# Altium project Final_Project.PrjPcb
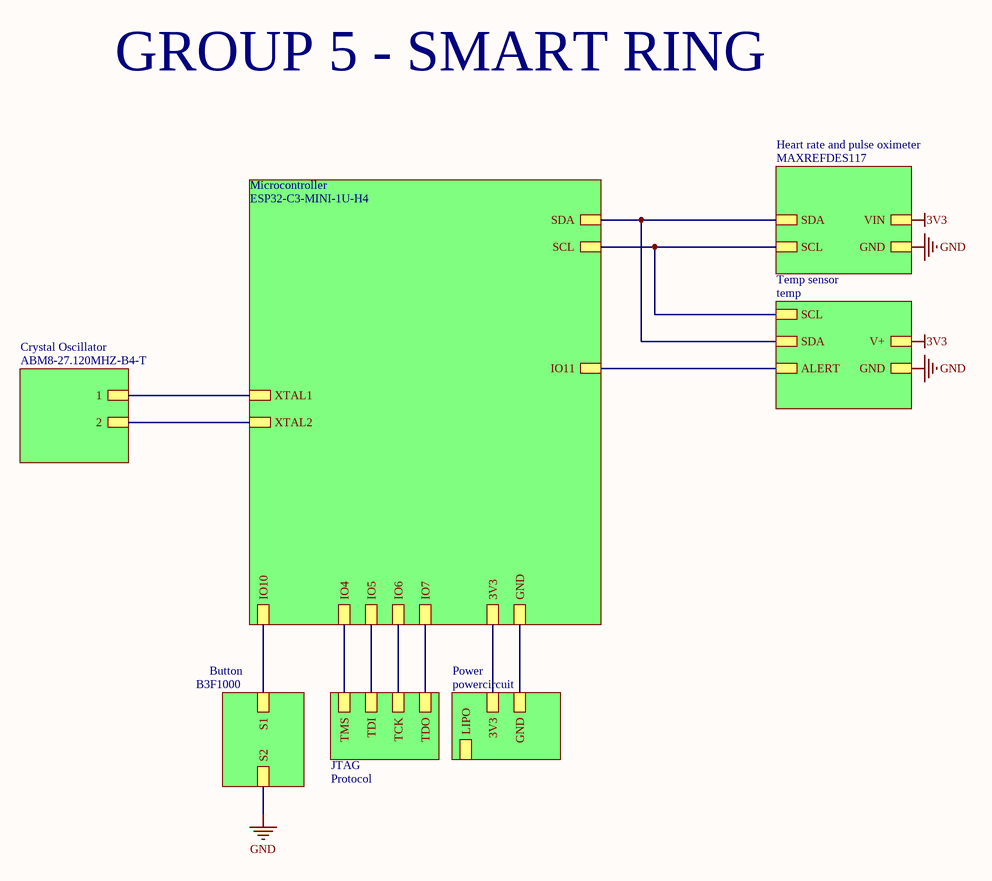
[diagram p0: mainsheet.SchDoc]
7 sheets, 39 parts. Net scope: hierarchical (ports join the sheet entries above them; power ports are global).
Board files: PCB2.PcbDoc, PCB4.PcbDoc
Sheets:
  mainsheet.SchDoc
    Heart rate and pulse oximeter = MAXREFDES117.SchDoc
    Button = B3F1000.SchDoc
    Temp sensor = temp.SchDoc
    Microcontroller = ESP32-C3-MINI-1U-H4.SchDoc
    Power = powercircuit.SchDoc
    Crystal Oscillator = ABM8-27.120MHZ-B4-T.SchDoc

## Sheet mainsheet.SchDoc
size A4; SheetNumber: 1; SheetTotal: 8

### Sub-sheets
Button = B3F1000: S1, S2
Crystal Oscillator = ABM8-27.120MHZ-B4-T: 1, 2
Heart rate and pulse oximeter = MAXREFDES117: SCL, SDA, GND, VIN
Microcontroller = ESP32-C3-MINI-1U-H4: GND, 3V3, IO10, IO4, IO5, IO6, IO7, SCL, SDA, XTAL1, XTAL2, IO11
Power = powercircuit: 3V3, GND, LIPO
Protocol = JTAG (file not in this document): TDO, TCK, TDI, TMS
Temp sensor = temp: SCL, GND, ALERT, V+, SDA

### Nets
3V3: sheet Heart rate and pulse oximeter/VIN, sheet Temp sensor/V+  [project net VIN]
GND: sheet Heart rate and pulse oximeter/GND, sheet Button/S2, sheet Temp sensor/GND
GPIO2: sheet Temp sensor/ALERT, sheet Microcontroller/IO11
GPIO18: sheet Heart rate and pulse oximeter/SCL, sheet Temp sensor/SCL, sheet Microcontroller/SCL
GPIO19: sheet Heart rate and pulse oximeter/SDA, sheet Temp sensor/SDA, sheet Microcontroller/SDA
To_Lipo_Bat: sheet Microcontroller/3V3, sheet Power/3V3, sheet Power/LIPO
XTAL_32K_N: sheet Microcontroller/XTAL2, sheet Crystal Oscillator/2
XTAL_32K_P: sheet Microcontroller/XTAL1, sheet Crystal Oscillator/1
NetC13_1: sheet Microcontroller/GND, sheet Power/GND
NetIC1_16: sheet Button/S1, sheet Microcontroller/IO10
NetIC1_18: sheet Microcontroller/IO4, sheet Protocol/TMS
NetIC1_19: sheet Microcontroller/IO5, sheet Protocol/TDI
NetIC1_20: sheet Microcontroller/IO6, sheet Protocol/TCK
NetIC1_21: sheet Microcontroller/IO7, sheet Protocol/TDO

### Notes on the sheet
- GROUP 5 - SMART RING

## Sheet MAXREFDES117.SchDoc
size A; SheetNumber: 2; SheetTotal: 8
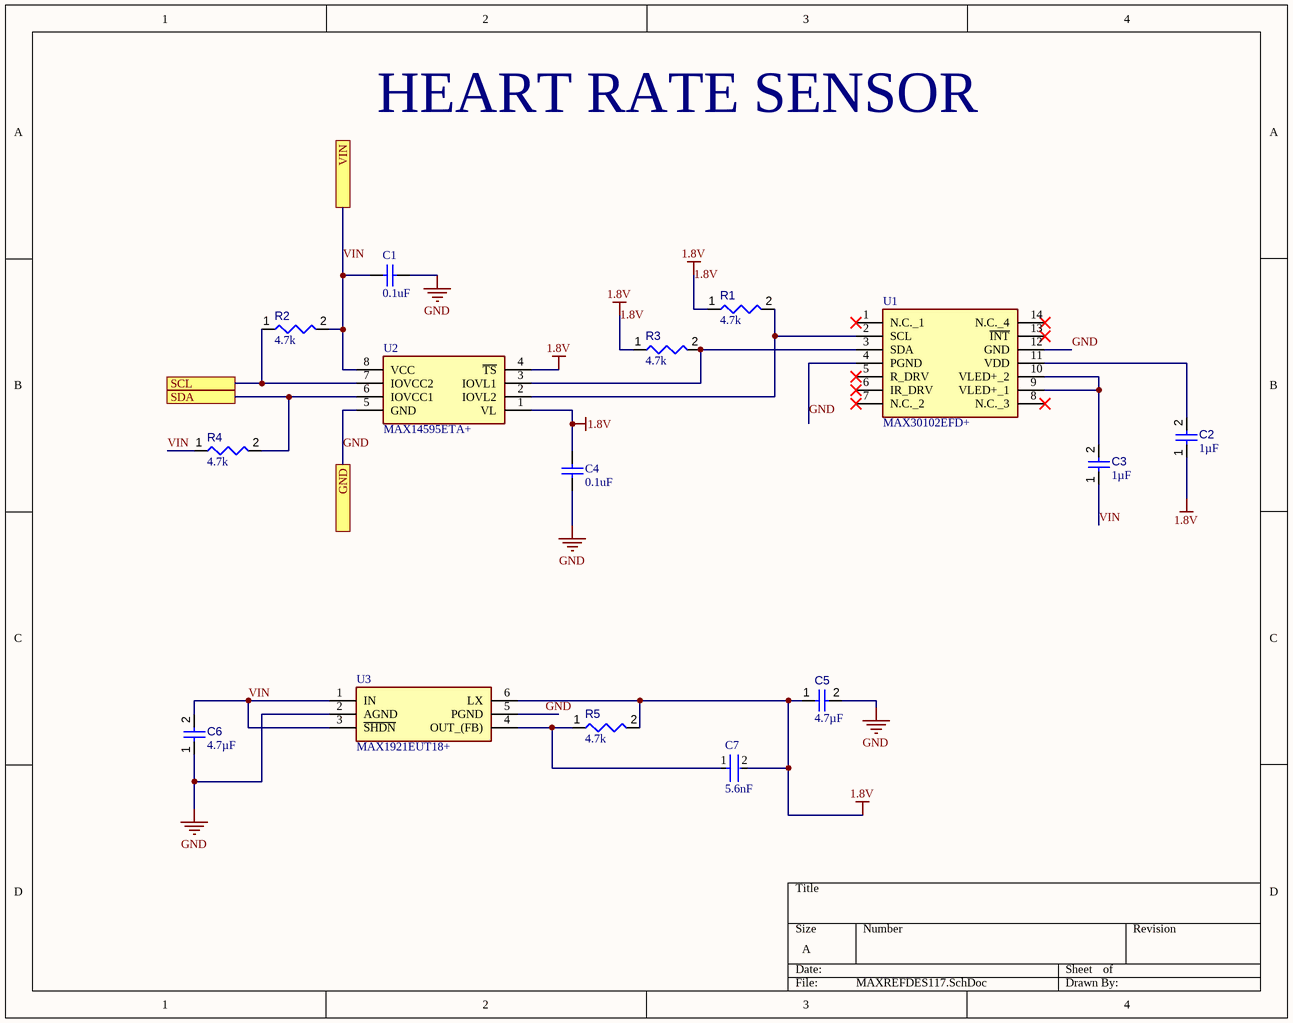
[diagram p1: MAXREFDES117.SchDoc]

### Parts
C1  0.1uF  [CAPC1608X90X35ML10T15]
C2  value 1µF  [CAPC0402(1005)60_L]  (hidden comment: Capacitor 1µF +/-20% 10V 0402)
C3  value 1µF  [CAPC0402(1005)60_L]  (hidden comment: Capacitor 1µF +/-20% 10V 0402)
C4  0.1uF  [CAPC1608X90X35ML10T15]
C5  value 4.7µF  [CAPC0603(1608)100_L]  (hidden comment: Capacitor 4.7µF +/-20% 10V 0603)
C6  value 4.7µF  [CAPC0603(1608)100_L]  (hidden comment: Capacitor 4.7µF +/-20% 10V 0603)
C7  5.6nF  [FP-C0603C-CF-MFG]
R1  value 4.7k  [RESC0402(1005)_L]  (hidden comment: 4D7KR2F)
R2  value 4.7k  [RESC0402(1005)_L]  (hidden comment: 4D7KR2F)
R3  value 4.7k  [RESC0402(1005)_L]  (hidden comment: 4D7KR2F)
R4  value 4.7k  [RESC0402(1005)_L]  (hidden comment: 4D7KR2F)
R5  value 4.7k  [RESC0402(1005)_L]  (hidden comment: 4D7KR2F)
U1  MAX30102EFD+  [14-LEAD-OESIP]
U2  MAX14595ETA+  [MAX14595ETA]
U3  MAX1921EUT18+  [SOT95P280X145-6N]

### Ports
GND (see mainsheet[4B], temp[3B]), SCL (see mainsheet[3B], ESP32-C3-MINI-1U-H4[2C], temp[2B]), SDA (see mainsheet[3B], ESP32-C3-MINI-1U-H4[2C], temp[2B]), VIN (see mainsheet[4B])

### Nets
1.8V: C2.1 C4.2 C5.1 C7.2 R1.1 R3.1 R5.2 U2.1(VL) U2.4(~{TS}) U3.6(LX)
GND: C1.1 C4.1 C5.2 C6.1 U1.4(PGND) U1.12(GND) U2.5(GND) U3.2(AGND) U3.5(PGND) ; port GND
VIN: C1.2 C3.1 C6.2 R2.2 R4.1 U2.8(VCC) U3.1(IN) U3.3(~{SHDN}) ; port VIN
GPIO18: R2.1 U2.7(IOVCC2) ; port SCL
GPIO19: R4.2 U2.6(IOVCC1) ; port SDA
NetC2_2: C2.2 U1.11(VDD)
NetC3_2: C3.2 U1.9(VLED+_1) U1.10(VLED+_2)
NetC7_1: C7.1 R5.1 U3.4(OUT_(FB))
NetR1_2: R1.2 U1.2(SCL) U2.2(IOVL2)
NetR3_2: R3.2 U1.3(SDA) U2.3(IOVL1)

Not connected (* = marked no-connect by the designer): U1 1(N.C._1)* 5(R_DRV)* 6(IR_DRV)* 7(N.C._2)* 8(N.C._3)* 13(~{INT})* 14(N.C._4)*

### Notes on the sheet
- HEART RATE SENSOR

### Library data of the parts
C1 C4 = CMP-2100-03643-1: Chip Capacitor, 0.1 uF, +/- 10%, 50 V, -55 to 125 degC, 0603 (1608 Metric), RoHS, Tape and Reel; Manufacturer: Murata; Dielectric Material: Ceramic; Voltage Rating: 50V; Capacitance: 100nF; Dielectric: X7R; Insulation Resistance: 10GR; Case Code (Metric): 1608; Lead Free: LeadFree; Depth: 0.8mm; Number of Pins: 2; Radiation Hardening: No; Case/Package: 0603; Manufacturer URL: http://www.murata.com/; Packaging: TapeandReel; Length: 1.6mm; Contact Plating: Tin; Datasheet URL: http://psearch.en.murata.com/capacitor/product/GRM188R71H104KA93%23.pdf; Tolerance: 10%; Case Code (Imperial): 0603; Min Operating Temperature: -55degC; RoHSCompliant: true; Voltage: 50V; Termination: SMD/SMT; Mount: SurfaceMount; Material: Ceramic; Package Quantity: 1; Height: 0.8mm; Thickness: 0.035inch; REACH SVHC: NoSVHC; Max Operating Temperature: 125degC; Width: 0.8mm; Package Reference: 0603; Voltage Rating (DC): 50V; Datasheet Version: 42675.0; Package Description: 2-Pin Surface Mount Device, Body 1.6 x 0.8 mm
C2 C3 = CMP-001-00063-3: Chip Capacitor, 1µF +/-20%, 10V, 0402, Thickness 0.6 mm; Tolerance: 10%; Mounting Technology: SMT; Max Operating Temperature: 85°C; Voltage Rating: 10V; Pins: 2; Case/Package: 0402; Min Operating Temperature: -55°C
C5 C6 = CMP-001-00076-4: Chip Capacitor, 4.7µF +/-20%, 10V, 0603, Thickness 1 mm; Tolerance: 10%; Mounting Technology: SMT; Case/Package: 0603; Pins: 2; Min Operating Temperature: -55°C; Max Operating Temperature: 85°C; Voltage Rating: 10V
C7 = CMP-2006-03359-2: CAP CER 5600PF 50V NP0 0603; Manufacturer: KEMET; Manufacturer Part Number: C0603C562J5GACTU; Material: Ceramic; Value: 5,600 pF; Tolerance: 0.05; Temperature Coefficient: 30ppm/°C; Temperature Characteristic: C0G; Automotive Grade: Grade 1; Device Class L1: Passive Components; Category: Cap; Temperature Range Low: -55°C; Voltage Rating: 50 V; ComponentLink2Description: Datasheet; Height: 0.87mm; Octopart: https://octopart.com/c0603c562j5gactu-kemet-13174209; Mouser Description: Multilayer Ceramic Capacitors MLCC - SMD/SMT 50volts 5600pF 5% C0G; Device Class L3: Ceramic Capacitors; Package: C0603C-CF; Temperature Range High: +125°C; Automotive: Yes; ComponentLink2URL: https://api.kemet.com/component-edge/download/datasheet/C0603C100J5GACAUTO.pdf; RoHS: TRUE; Device Class L2: Capacitors; Digikey Description: CAP CER 5600PF 50V NP0 0603; Temperature: -55°C to +125°C; Capacitance: 5,600 pF; Lead Free: Yes
R1-R5 = CMP-009-00105-2: 4K7 0.063W 1% 0402 (1005 Metric)  SMD; Power: 63mW; Mounting Technology: SMT; Case/Package: 0402; Tolerance: 1%; Pins: 2
U1 = MAX30102EFD+: Integrated Circuit; Manufacturer_Name: Analog Devices; Datasheet Link: https://datasheets.maximintegrated.com/en/ds/MAX30102.pdf; Manufacturer_Part_Number: MAX30102EFD+; Mouser Part Number: 700-MAX30102EFD+; Mouser Price/Stock: https://www.mouser.co.uk/ProductDetail/Analog-Devices-Maxim-Integrated/MAX30102EFD%2b?qs=nVS1qgv%252BQrk9UYEvS27V%2Fg%3D%3D
U2 = MAX14595ETA+: Integrated Circuit; Manufacturer_Name: Analog Devices; Datasheet Link: https://www.mouser.it/datasheet/2/256/MAX14595-471922.pdf; Height: 0.8mm; Manufacturer_Part_Number: MAX14595ETA+; Mouser Part Number: 700-MAX14595ETA+; Mouser Price/Stock: https://www.mouser.co.uk/ProductDetail/Maxim-Integrated/MAX14595ETA%2b?qs=Or6ezLSzmEvDejm1TC8ZVA%3D%3D
U3 = MAX1921EUT18+: Integrated Circuit; Manufacturer_Name: Analog Devices; Datasheet Link: https://datasheet.datasheetarchive.com/originals/distributors/SFDatasheet-4/sf-00087114.pdf; Height: 1.45mm; Manufacturer_Part_Number: MAX1921EUT18+

## Sheet B3F1000.SchDoc
size A; SheetNumber: 7; SheetTotal: 8
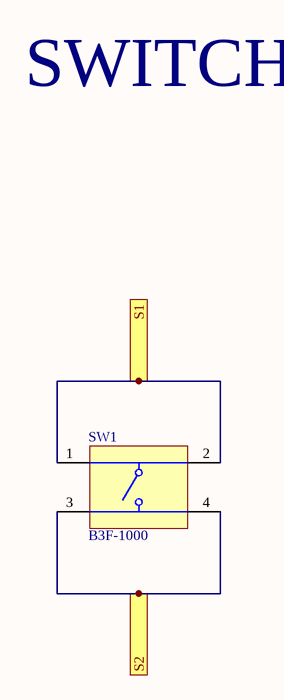
[diagram p2: B3F1000.SchDoc]

### Parts
SW1  B3F-1000  [OMRON-B3F-1000-4_V]

### Ports
S1 (see mainsheet[2C]), S2 (see mainsheet[2D])

### Nets
GND: SW1.3 SW1.4 ; port S2
NetIC1_16: SW1.1 SW1.2 ; port S1

### Notes on the sheet
- SWITCH

### Library data of the parts
SW1 = CMP-1677-00002-1: Tactile Switch, SPST-NO, 0.05 A, 5 to 24 V, -25 to 70 degC, 4-Pin THD, RoHS, Bulk; Shielding: Shielded; Gender: Female; Capacitance: -45 f; Voltage Rating: 150 V; Current Rating: 1.5 A; Radiation Hardening: No; Contact Plating: Gold; Height: 14.99 mm; Min Operating Temperature: -40 degC; Packaging: Tray; ComponentLink2Description: Datasheet; ComponentLink1URL: http://www.omron.com/; Lead Pitch: 1.27 mm; RoHSCompliant: true; Pins: 8; PackageReference: B3F-1000; Width: 25.4 mm; Contact Material: Brass; ComponentLink2URL: http://www.omron.com/ecb/products/pdf/en-b3f.pdf; PackageDescription: 4-Pin Through Hole Device, Body 6 x 6 mm; DatasheetVersion: Jan-15; ComponentLink1Description: Manufacturer URL; Package Quantity: 1080; Mount: Through Hole; Length: 18.34 mm; Max Operating Temperature: 70 degC

## Sheet temp.SchDoc
size A4; SheetNumber: 3; SheetTotal: 8
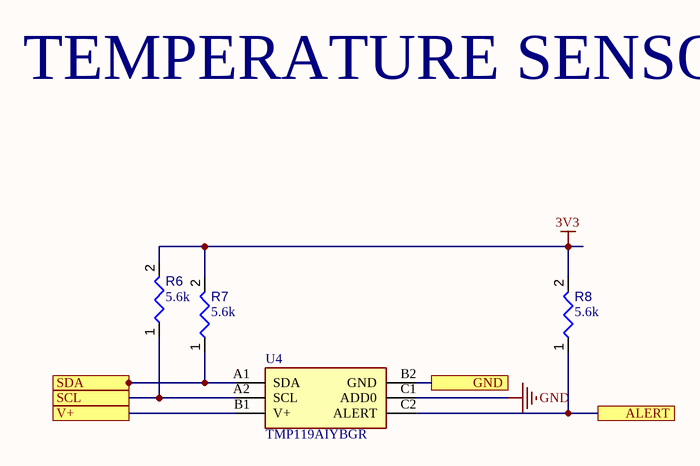
[diagram p3: temp.SchDoc]

### Parts
R6  value 5.6k  [RESC0402(1005)_L]  (hidden comment: Resistor 5K6  +/-5 % 0402 63 mW)
R7  value 5.6k  [RESC0402(1005)_L]  (hidden comment: Resistor 5K6  +/-5 % 0402 63 mW)
R8  value 5.6k  [RESC0402(1005)_L]  (hidden comment: Resistor 5K6  +/-5 % 0402 63 mW)
U4  TMP119AIYBGR  [BGA6C40P2X3_95X149X52]

### Ports
ALERT (see mainsheet[3B]), GND (see mainsheet[4B], MAXREFDES117[2C]), SCL (see mainsheet[3B], ESP32-C3-MINI-1U-H4[2C], MAXREFDES117[1B]), SDA (see mainsheet[3B], ESP32-C3-MINI-1U-H4[2C], MAXREFDES117[1B]), V+ (see mainsheet[4B])

### Nets
3V3: R6.2 R7.2 R8.2 U4.B1(V+) ; port V+  [project net VIN]
GND: U4.B2(GND) U4.C1(ADD0) ; port GND
GPIO2: R8.1 U4.C2(ALERT) ; port ALERT
GPIO18: R6.1 U4.A2(SCL) ; port SCL
GPIO19: R7.1 U4.A1(SDA) ; port SDA

### Notes on the sheet
- TEMPERATURE SENSOR

### Library data of the parts
R6-R8 = CMP-009-00136-3: Chip Resistor, 5,6 kOhms, +/-5 %, 63 mW, -55 to 155 degC, 0402; Power: 63mW; Tolerance: 5%; Max Operating Temperature: 155°C; Case/Package: 0402; Min Operating Temperature: -55°C; Pins: 2
U4 = TMP119AIYBGR: Integrated Circuit; Manufacturer_Name: Texas Instruments; Datasheet Link: https://www.ti.com/lit/ds/symlink/tmp119.pdf?ts=1711471230059&ref_url=https%253A%252F%252Fwww.ti.com%252Fsitesearch%252Fen-us%252Fdocs%252Funiversalsearch.tsp%253FlangPref%253Den-US%2526searchTerm%253Dtmp119%2526nr%253D70; Height: 0.525mm; Manufacturer_Part_Number: TMP119AIYBGR; Mouser Part Number: 595-TMP119AIYBGR; Mouser Price/Stock: https://www.mouser.co.uk/ProductDetail/Texas-Instruments/TMP119AIYBGR?qs=dbcCsuKDzFUz%2FSabBerKMA%3D%3D

## Sheet ESP32-C3-MINI-1U-H4.SchDoc
size A; SheetNumber: 4; SheetTotal: 8
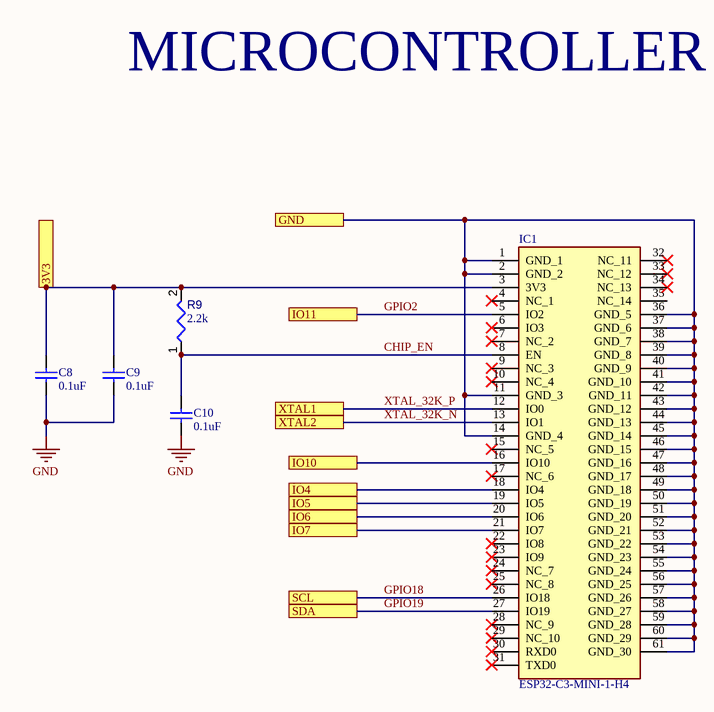
[diagram p4: ESP32-C3-MINI-1U-H4.SchDoc]

### Parts
C8  0.1uF  [CAPC1608X90X35ML10T15]
C9  0.1uF  [CAPC1608X90X35ML10T15]
C10  0.1uF  [CAPC1608X90X35ML10T15]
IC1  ESP32-C3-MINI-1-H4  [ESP32C3MINI1H4]
R9  value 2.2k  [RESC0402(1005)_L]  (hidden comment: Resistor 2K2  +/-5 % 0402 63 mW)

### Ports
3V3 (see mainsheet[3C], powercircuit[1B]), GND (see mainsheet[3C], powercircuit[1C]), IO4 (see mainsheet[2C]), IO5 (see mainsheet[2C]), IO6 (see mainsheet[2C]), IO7 (see mainsheet[2C]), IO10 (see mainsheet[2C]), IO11 (see mainsheet[3B]), SCL (see mainsheet[3B], MAXREFDES117[1B], temp[2B]), SDA (see mainsheet[3B], MAXREFDES117[1B], temp[2B]), XTAL1 (see mainsheet[2B]), XTAL2 (see mainsheet[2B])

### Nets
GND: C8.2 C9.2 C10.2
CHIP_EN: C10.1 IC1.8(EN) R9.1
GPIO2: IC1.5(IO2) ; port IO11
GPIO18: IC1.26(IO18) ; port SCL
GPIO19: IC1.27(IO19) ; port SDA
To_Lipo_Bat: C8.1 C9.1 IC1.3(3V3) R9.2 ; port 3V3
XTAL_32K_N: IC1.13(IO1) ; port XTAL2
XTAL_32K_P: IC1.12(IO0) ; port XTAL1
NetC13_1: IC1.1(GND_1) IC1.2(GND_2) IC1.11(GND_3) IC1.14(GND_4) IC1.36(GND_5) IC1.37(GND_6) IC1.38(GND_7) IC1.39(GND_8) IC1.40(GND_9) IC1.41(GND_10) IC1.42(GND_11) IC1.43(GND_12) IC1.44(GND_13) IC1.45(GND_14) IC1.46(GND_15) IC1.47(GND_16) IC1.48(GND_17) IC1.49(GND_18) IC1.50(GND_19) IC1.51(GND_20) IC1.52(GND_21) IC1.53(GND_22) IC1.54(GND_23) IC1.55(GND_24) IC1.56(GND_25) IC1.57(GND_26) IC1.58(GND_27) IC1.59(GND_28) IC1.60(GND_29) IC1.61(GND_30) ; port GND
NetIC1_16: IC1.16(IO10) ; port IO10
NetIC1_18: IC1.18(IO4) ; port IO4
NetIC1_19: IC1.19(IO5) ; port IO5
NetIC1_20: IC1.20(IO6) ; port IO6
NetIC1_21: IC1.21(IO7) ; port IO7

Not connected (* = marked no-connect by the designer): IC1 4(NC_1)* 6(IO3)* 7(NC_2)* 9(NC_3)* 10(NC_4)* 15(NC_5)* 17(NC_6)* 22(IO8)* 23(IO9)* 24(NC_7)* 25(NC_8)* 28(NC_9)* 29(NC_10)* 30(RXD0)* 31(TXD0)* 32(NC_11)* 33(NC_12)* 34(NC_13)* 35(NC_14)

### Notes on the sheet
- MICROCONTROLLER

### Library data of the parts
C8-C10 = CMP-2100-03643-1: as C1 on sheet MAXREFDES117; Case Code (Metric): 1608; Lead Free: LeadFree; Depth: 0.8mm; Number of Pins: 2; Radiation Hardening: No; Case/Package: 0603; Manufacturer URL: http://www.murata.com/; Packaging: TapeandReel; Length: 1.6mm; Contact Plating: Tin; Datasheet URL: http://psearch.en.murata.com/capacitor/product/GRM188R71H104KA93%23.pdf; Tolerance: 10%; Case Code (Imperial): 0603; Min Operating Temperature: -55degC; RoHSCompliant: true; Voltage: 50V; Termination: SMD/SMT; Mount: SurfaceMount; Material: Ceramic; Package Quantity: 1; Height: 0.8mm; Thickness: 0.035inch; REACH SVHC: NoSVHC; Max Operating Temperature: 125degC; Width: 0.8mm; Package Reference: 0603; Voltage Rating (DC): 50V; Datasheet Version: 42675.0; Package Description: 2-Pin Surface Mount Device, Body 1.6 x 0.8 mm
IC1 = ESP32-C3-MINI-1-H4: Integrated Circuit; Manufacturer_Name: Espressif Systems; Datasheet Link: https://www.mouser.es/datasheet/2/891/Espressif_ESP32_C3_MINI_1_Datasheet-2006822.pdf; Height: 2.55mm; Manufacturer_Part_Number: ESP32-C3-MINI-1-H4; Mouser Part Number: 356-ESP32-C3-MINI1H4; Mouser Price/Stock: https://www.mouser.co.uk/ProductDetail/Espressif-Systems/ESP32-C3-MINI-1-H4?qs=stqOd1AaK78JkwNX13Q9hQ%3D%3D
R9 = CMP-009-00166-3: Chip Resistor, 2,2 kOhms, +/-5 %, 63 mW, -55 to 155 degC, 0402; Power: 63mW; Tolerance: 5%; Pins: 2; Min Operating Temperature: -55°C; Max Operating Temperature: 155°C; Case/Package: 0402

## Sheet powercircuit.SchDoc
size A4; SheetNumber: 8; SheetTotal: 8
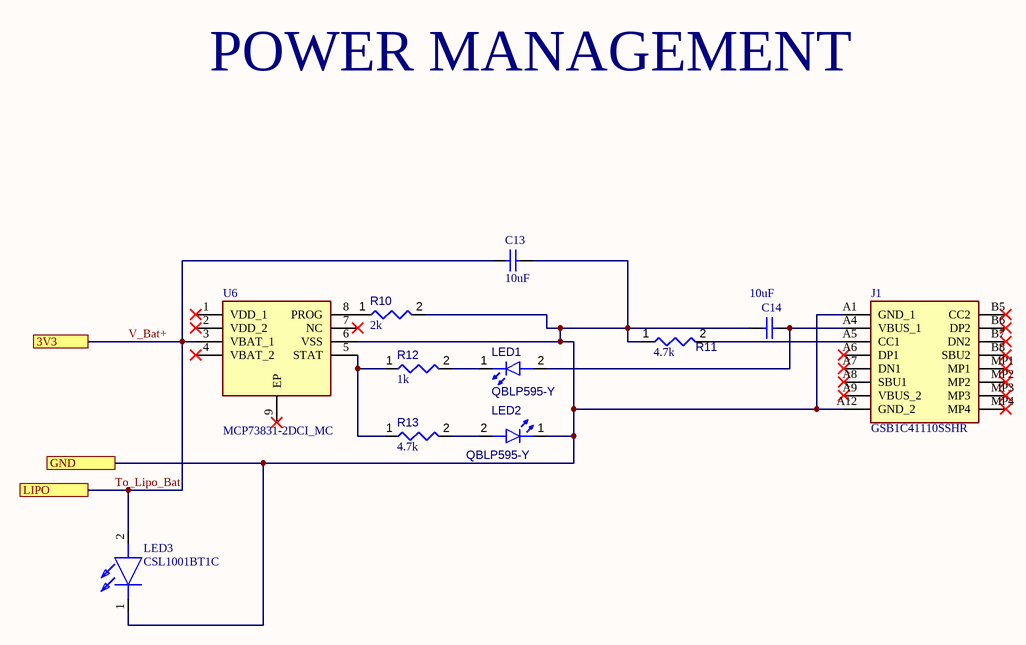
[diagram p5: powercircuit.SchDoc]

### Parts
C13  10uF  [CAPC1608X90X35ML10T15]
C14  10uF  [CAPC1608X90X35ML10T15]
J1  GSB1C41110SSHR  [GSB1C41110SSHR]
LED1  QBLP595-Y  [QTB-QBLP595_V]
LED2  QBLP595-Y  [QTB-QBLP595_V]
LED3  CSL1001BT1C  [CSL1001BT1C]
R10  value 2k  [RESC0402(1005)_L]  (hidden comment: 2KR2J)
R11  value 4.7k  [RESC0402(1005)_L]  (hidden comment: Resistor 4K7  +/-1 % 0402 63 mW)
R12  value 1k  [RESC0402(1005)_L]  (hidden comment: 1KR2J)
R13  value 4.7k  [RESC0402(1005)_L]  (hidden comment: Resistor 4K7  +/-1 % 0402 63 mW)
U6  MCP73831-2DCI_MC  [SON50P300X200X100-9N-D]

### Ports
3V3 (see mainsheet[3C], ESP32-C3-MINI-1U-H4[1B]), GND (see mainsheet[3C], ESP32-C3-MINI-1U-H4[2B]), LIPO (see mainsheet[3D])

### Nets
To_Lipo_Bat: C13.2 LED3.2(A) U6.3(VBAT_1) ; port 3V3, port LIPO  [also labelled V_Bat+]
NetC13_1: C13.1 C14.2 J1.A1(GND_1) J1.A12(GND_2) LED2.1(K) LED3.1(K) R10.2 R11.1 U6.6(VSS) ; port GND
NetC14_1: C14.1 J1.A4(VBUS_1) LED1.2(A)
NetJ1_A5: J1.A5(CC1) R11.2
NetLED1_1: LED1.1(K) R12.2
NetLED2_2: LED2.2(A) R13.2
NetR10_1: R10.1 U6.8(PROG)
NetR12_1: R12.1 R13.1 U6.5(STAT)

Not connected (* = marked no-connect by the designer): J1 A6(DP1)* A7(DN1)* A8(SBU1)* A9(VBUS_2)* B5(CC2)* B6(DP2)* B7(DN2)* B8(SBU2)* MP1* MP2* MP3* MP4*; U6 1(VDD_1)* 2(VDD_2)* 4(VBAT_2)* 7(NC)* 9(EP)*

### Notes on the sheet
- POWER MANAGEMENT

### Library data of the parts
C13 C14 = CMP-2100-03643-1: as C1 on sheet MAXREFDES117; Case Code (Metric): 1608; Lead Free: LeadFree; Depth: 0.8mm; Number of Pins: 2; Radiation Hardening: No; Case/Package: 0603; Manufacturer URL: http://www.murata.com/; Packaging: TapeandReel; Length: 1.6mm; Contact Plating: Tin; Datasheet URL: http://psearch.en.murata.com/capacitor/product/GRM188R71H104KA93%23.pdf; Tolerance: 10%; Case Code (Imperial): 0603; Min Operating Temperature: -55degC; RoHSCompliant: true; Voltage: 50V; Termination: SMD/SMT; Mount: SurfaceMount; Material: Ceramic; Package Quantity: 1; Height: 0.8mm; Thickness: 0.035inch; REACH SVHC: NoSVHC; Max Operating Temperature: 125degC; Width: 0.8mm; Package Reference: 0603; Voltage Rating (DC): 50V; Datasheet Version: 42675.0; Package Description: 2-Pin Surface Mount Device, Body 1.6 x 0.8 mm
J1 = GSB1C41110SSHR: Connector; Manufacturer_Name: Amphenol Communications Solutions; Datasheet Link: https://cdn.amphenol-cs.com/media/wysiwyg/files/drawing/gsb1c41x10sshr-ax1.pdf; Height: 3.41mm; Manufacturer_Part_Number: GSB1C41110SSHR
LED1 LED2 = CMP-007-00043-3: Chip LED 0402, Yellow, 0.02 A, 3.1 to 3.7 V, -40 to 80 degC, 2-Pin SMD, RoHS, Tape and Reel; Mounting Technology: SMT; Case/Package: 0402; RoHS Compliant: Yes; Pins: 2; Colour: Yellow
LED3 = CSL1001BT1C: LED; Manufacturer_Name: ROHM Semiconductor; Datasheet Link: https://fscdn.rohm.com/en/products/databook/datasheet/opto/led/chip_mono/csl1001bt1(c)-e.pdf; Height: 1.16mm; Manufacturer_Part_Number: CSL1001BT1C; Mouser Part Number: 755-CSL1001BT1C; Mouser Price/Stock: https://www.mouser.co.uk/ProductDetail/ROHM-Semiconductor/CSL1001BT1C?qs=HoCaDK9Nz5fqNTX3Pg0ReA%3D%3D
R10 = CMP-009-00091-2: 2K 0.063W 5% 0402 (1005 Metric)  SMD; Power: 63mW; Case/Package: 0402; Mounting Technology: SMT; Tolerance: 5%; Pins: 2
R11 R13 = CMP-009-00158-3: Chip Resistor, 4,7 kOhms, +/-1 %, 63 mW, -55 to 155 degC, 0402; Power: 63mW; Tolerance: 1%; Max Operating Temperature: 155°C; Pins: 2; Min Operating Temperature: -55°C; Case/Package: 0402
R12 = CMP-009-00075-2: 1K 0.063W 5% 0402 (1005 Metric)  SMD; Power: 63mW; Pins: 2; Mounting Technology: SMT; Case/Package: 0402; Tolerance: 5%
U6 = MCP73831-2DCI_MC: Integrated Circuit; Manufacturer_Name: Microchip; Manufacturer_Part_Number: MCP73831-2DCI/MC; Datasheet Link: https://www.arrow.com/en/products/mcp73831-2dcimc/microchip-technology; Height: 1mm; Mouser Part Number: 579-MCP73831-2DCI/MC; Mouser Price/Stock: https://www.mouser.co.uk/ProductDetail/Microchip-Technology/MCP73831-2DCI-MC?qs=hH%252BOa0VZEiBQ%2FrptDRXKdg%3D%3D; Arrow Part Number: MCP73831-2DCI/MC; Arrow Price/Stock: https://www.arrow.com/en/products/mcp73831-2dcimc/microchip-technology?region=nac

## Sheet ABM8-27.120MHZ-B4-T.SchDoc
size A; SheetNumber: 6; SheetTotal: 8
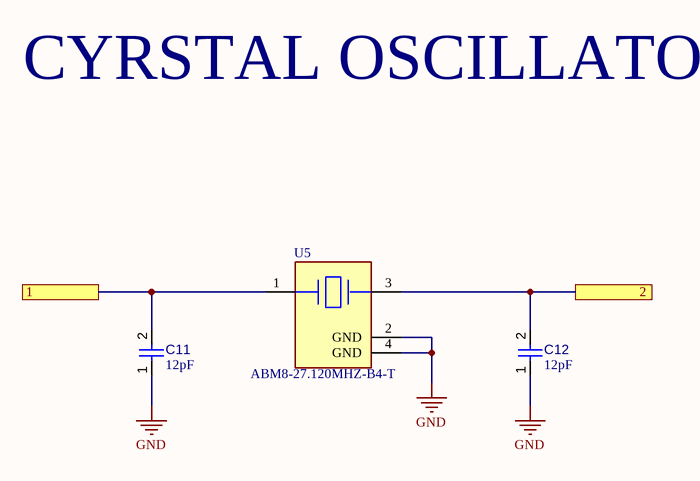
[diagram p6: ABM8-27.120MHZ-B4-T.SchDoc]

### Parts
C11  value 12pF  [CAPC0402(1005)33_L]  (hidden comment: Capacitor 12pF +/-10% 50V 0402)
C12  value 12pF  [CAPC0402(1005)33_L]  (hidden comment: Capacitor 12pF +/-10% 50V 0402)
U5  ABM8-27.120MHZ-B4-T  [FP-ABM8-MFG]

### Ports
1 (see mainsheet[2B]), 2 (see mainsheet[2B])

### Nets
GND: C11.1 C12.1 U5.2(GND) U5.4(GND)
XTAL_32K_N: C12.2 U5.3 ; port 2
XTAL_32K_P: C11.2 U5.1 ; port 1

### Notes on the sheet
- CYRSTAL OSCILLATOR

### Library data of the parts
C11 C12 = CMP-001-00072-4: Chip Capacitor, 12pF +/-10%, 50V, 0402, Thickness 0.33 mm; Tolerance: 20%; Pins: 2; Max Operating Temperature: 85°C; Case/Package: 0402; Voltage Rating: 50V; Mounting Technology: SMT; Min Operating Temperature: -55°C
U5 = CMP-27762-000994-1: Crystal 27.12MHz ±30ppm 18pF SMD-4 3.2mm x 2.5mm; ESR (Equivalent Series Resistance): 50R; Frequency Stability: 50ppm; Capacitance: 1.8E-11F; Height: 0.031inch; Load Capacitance: 18pF; Width: 0.098inch; Packaging: Tape and Reel; Lead Free: Lead Free; Frequency Tolerance: 30ppm; Max Operating Temperature: 70°C; Length: 0.126inch; Case/Package: SMD/SMT; Mount: Surface Mount; Min Operating Temperature: -20°C; RoHS Compliant: Yes; Frequency: 27.12MHz

## Nets that join several sheets
GND: MAXREFDES117 (9 pins), B3F1000 (SW1.3 SW1.4), temp (U4.B2 U4.C1), ESP32-C3-MINI-1U-H4 (C8.2 C9.2 C10.2), ABM8-27.120MHZ-B4-T (C11.1 C12.1 U5.2 U5.4)
VIN: MAXREFDES117 (8 pins), temp (R6.2 R7.2 R8.2 U4.B1)
GPIO2: temp (R8.1 U4.C2), ESP32-C3-MINI-1U-H4 (IC1.5)
GPIO18: MAXREFDES117 (R2.1 U2.7), temp (R6.1 U4.A2), ESP32-C3-MINI-1U-H4 (IC1.26)
GPIO19: MAXREFDES117 (R4.2 U2.6), temp (R7.1 U4.A1), ESP32-C3-MINI-1U-H4 (IC1.27)
NetC13_1: ESP32-C3-MINI-1U-H4 (30 pins), powercircuit (9 pins)
NetIC1_16: B3F1000 (SW1.1 SW1.2), ESP32-C3-MINI-1U-H4 (IC1.16)
To_Lipo_Bat: ESP32-C3-MINI-1U-H4 (C8.1 C9.1 IC1.3 R9.2), powercircuit (C13.2 LED3.2 U6.3)
XTAL_32K_N: ESP32-C3-MINI-1U-H4 (IC1.13), ABM8-27.120MHZ-B4-T (C12.2 U5.3)
XTAL_32K_P: ESP32-C3-MINI-1U-H4 (IC1.12), ABM8-27.120MHZ-B4-T (C11.2 U5.1)